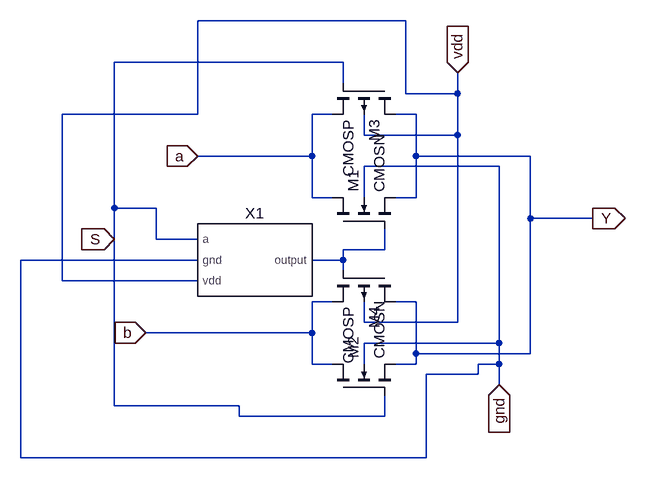
[diagram p0: schematic 2_1mux.asc]
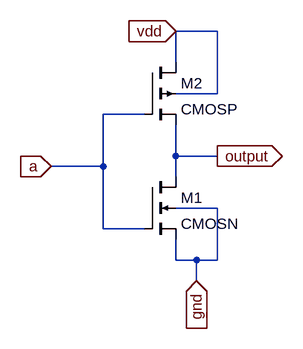
[diagram p1: sub-circuit inveter.asc]
2_1mux.asc, the LTspice schematic file:
Version 4
SHEET 1 880 680
WIRE 272 -112 -48 -112
WIRE 176 -48 -176 -48
WIRE 176 -16 176 -48
WIRE 272 0 272 -112
WIRE 352 0 352 -32
WIRE 352 0 272 0
WIRE -48 32 -48 -112
WIRE -48 32 -256 32
WIRE 160 32 128 32
WIRE 288 32 256 32
WIRE 208 64 208 32
WIRE 352 64 352 0
WIRE 352 64 208 64
WIRE 128 96 128 32
WIRE 128 96 -48 96
WIRE 288 96 288 32
WIRE 464 96 288 96
WIRE 416 112 208 112
WIRE 128 160 128 96
WIRE 160 160 128 160
WIRE 208 160 208 112
WIRE 288 160 288 96
WIRE 288 160 256 160
WIRE -176 176 -176 -48
WIRE -112 176 -176 176
WIRE 464 192 464 96
WIRE 560 192 464 192
WIRE -176 224 -176 176
WIRE -112 224 -112 176
WIRE -48 224 -112 224
WIRE 240 240 240 208
WIRE 240 240 176 240
WIRE -48 256 -320 256
WIRE 176 256 176 240
WIRE 176 256 128 256
WIRE 176 272 176 256
WIRE -256 288 -256 32
WIRE -48 288 -256 288
WIRE 160 320 128 320
WIRE 288 320 256 320
WIRE 208 352 208 320
WIRE 352 352 352 64
WIRE 352 352 208 352
WIRE 128 368 128 320
WIRE 128 368 -128 368
WIRE 416 384 416 112
WIRE 416 384 208 384
WIRE 288 400 288 320
WIRE 464 400 464 192
WIRE 464 400 288 400
WIRE 128 416 128 368
WIRE 160 416 128 416
WIRE 208 416 208 384
WIRE 288 416 288 400
WIRE 288 416 256 416
WIRE 416 416 416 384
WIRE 416 416 384 416
WIRE 384 432 384 416
WIRE 384 432 304 432
WIRE 416 448 416 416
WIRE -176 480 -176 224
WIRE 16 480 -176 480
WIRE 16 496 16 480
WIRE 240 496 240 464
WIRE 240 496 16 496
WIRE -320 560 -320 256
WIRE 304 560 304 432
WIRE 304 560 -320 560
FLAG 416 448 gnd
IOPIN 416 448 In
FLAG 352 -32 vdd
IOPIN 352 -32 In
FLAG -48 96 a
IOPIN -48 96 In
FLAG -128 368 b
IOPIN -128 368 In
FLAG 560 192 Y
IOPIN 560 192 Out
FLAG -176 224 S
IOPIN -176 224 In
SYMBOL cmosn 160 208 R270
SYMATTR InstName M1
SYMATTR Value2 l=180n w=1u
SYMBOL cmosn 160 464 R270
SYMATTR InstName M2
SYMATTR Value2 l=180n w=1u
SYMBOL cmosp 256 -16 R90
SYMATTR InstName M3
SYMATTR Value2 l=180n w=1u
SYMBOL cmosp 256 272 R90
SYMATTR InstName M4
SYMATTR Value2 l=180n w=1u
SYMBOL inveter 32 256 R0
SYMATTR InstName X1

inveter.asc, the sub-circuit schematic file:
Version 4
SHEET 1 880 680
WIRE -16 -240 -80 -240
WIRE -80 -192 -80 -240
WIRE -16 -144 -16 -240
WIRE -16 -144 -80 -144
WIRE -128 -112 -192 -112
WIRE -80 -48 -80 -96
WIRE -16 -48 -80 -48
WIRE -192 -32 -192 -112
WIRE -192 -32 -272 -32
WIRE -80 -16 -80 -48
WIRE -16 32 -80 32
WIRE -192 64 -192 -32
WIRE -128 64 -192 64
WIRE -80 112 -80 80
WIRE -48 112 -80 112
WIRE -16 112 -16 32
WIRE -16 112 -48 112
WIRE -48 144 -48 112
FLAG -272 -32 a
IOPIN -272 -32 In
FLAG -16 -48 output
IOPIN -16 -48 Out
FLAG -80 -240 vdd
IOPIN -80 -240 In
FLAG -48 144 gnd
IOPIN -48 144 In
SYMBOL cmosn -128 -16 R0
SYMATTR InstName M1
SYMATTR Value2 l=180n w=2u
SYMBOL cmosp -128 -192 R0
SYMATTR InstName M2
SYMATTR Value2 l=180n w=2u

The netlist it stands for:
* 2_1mux.asc
M1 a N001 Y gnd CMOSN l=180n w=1u
M2 b S Y gnd CMOSN l=180n w=1u
M3 Y S a vdd CMOSP l=180n w=1u
M4 Y N001 b vdd CMOSP l=180n w=1u
XX1 S gnd vdd N001 inveter

* block symbol definitions
.subckt inveter a gnd vdd output
M1 output a gnd gnd CMOSN l=180n w=2u
M2 vdd a output vdd CMOSP l=180n w=2u
.ends inveter

.model NMOS NMOS
.model PMOS PMOS
.lib standard.mos
.backanno
.end